# EAGLE schematic +-50vrailtorailwithBoost (EAGLE 9.6.2)
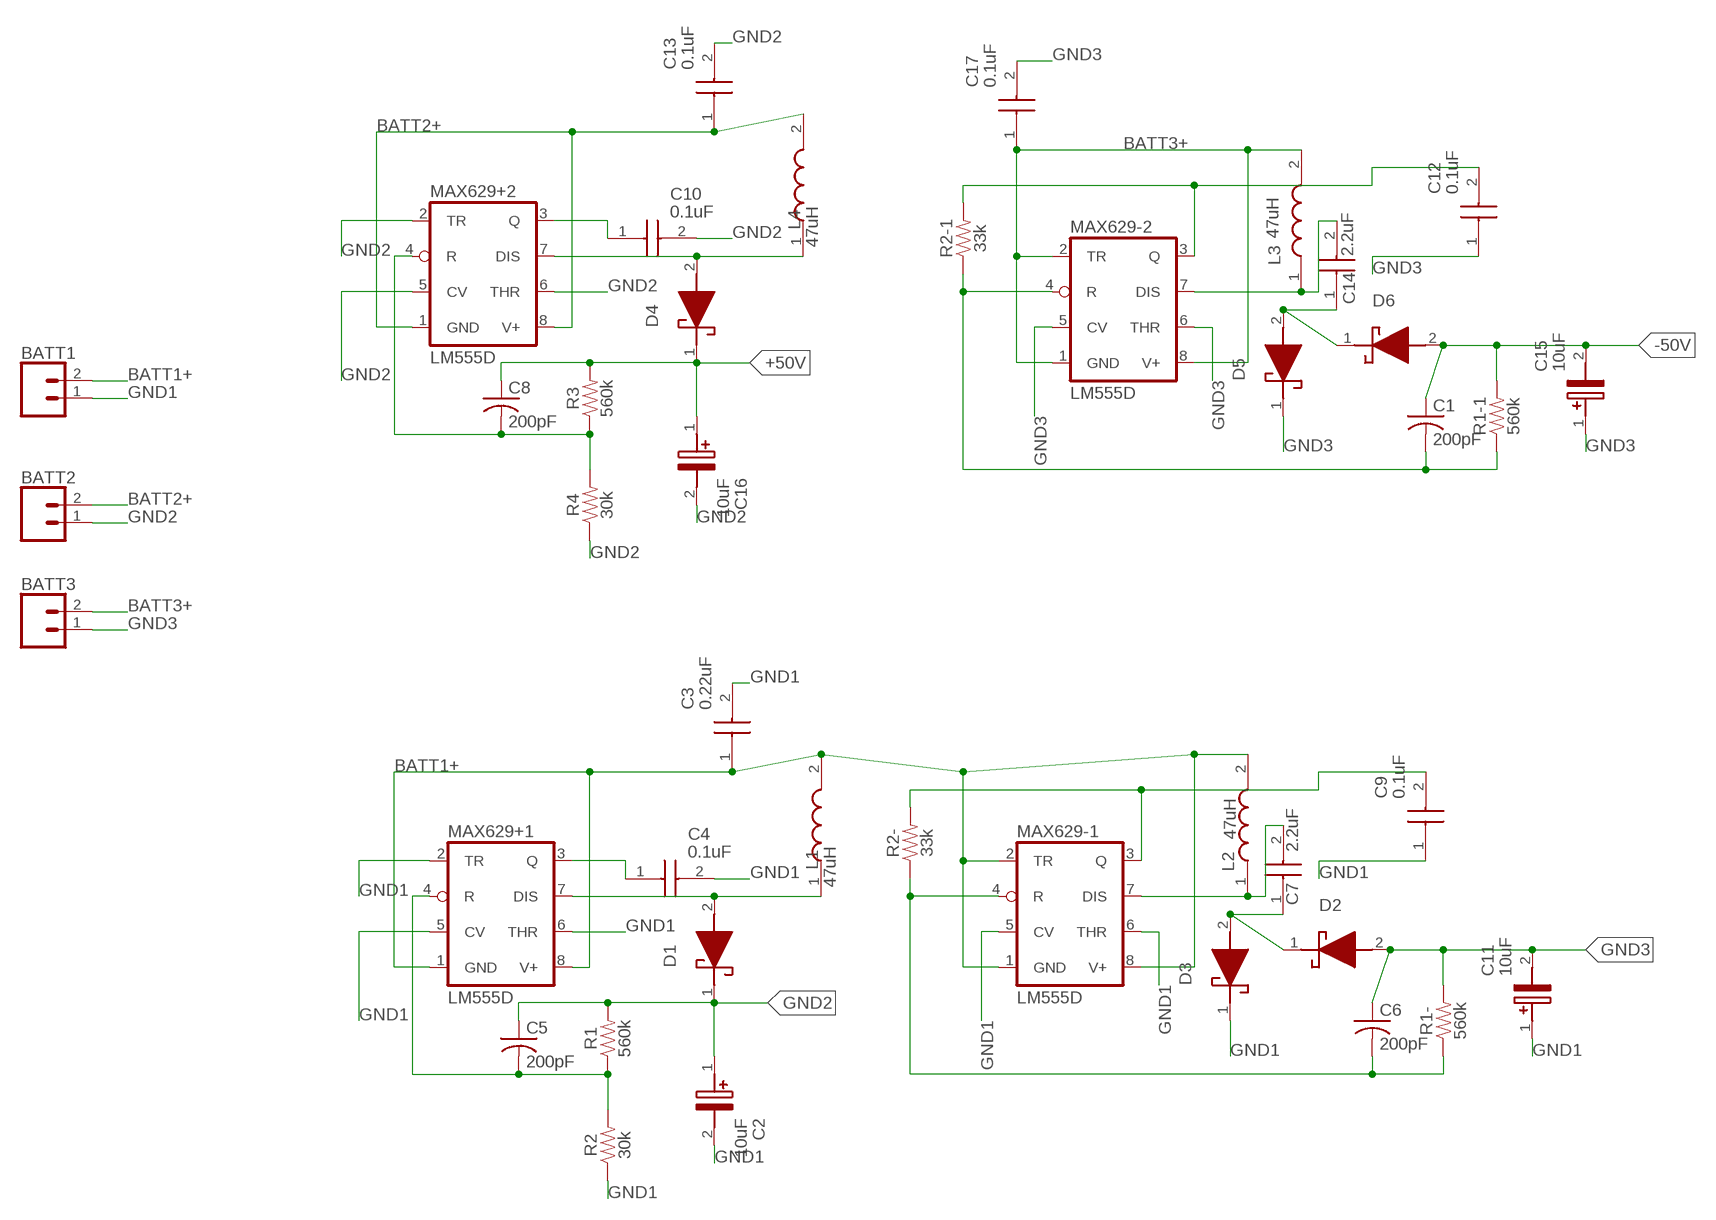
[diagram p0: schematic, sheet 1]

## Parts
BATT1  CONN_02  [1X02]
BATT2  CONN_02  [1X02]
BATT3  CONN_02  [1X02]
C1  200pF  C-USC1206  [C1206]
C2  10uF  EEE-FN1H100UR  [EEE1AA220WR]
C3  0.22uF  C1206C224J1RACAUTO  [C1206]
C4  0.1uF  C1206X222KGRACAUTO  [CAPC3316X195N]
C5  200pF  C-USC1206  [C1206]
C6  200pF  C-USC1206  [C1206]
C7  2.2uF  08055C225KAT2A  [CAPC2012X152N]
C8  200pF  C-USC1206  [C1206]
C9  0.1uF  C1206X222KGRACAUTO  [CAPC3316X195N]
C10  0.1uF  C1206X222KGRACAUTO  [CAPC3316X195N]
C11  10uF  EEE-FN1H100UR  [EEE1AA220WR]
C12  0.1uF  C1206X222KGRACAUTO  [CAPC3316X195N]
C13  0.1uF  C1206C224J1RACAUTO  [C1206]
C14  2.2uF  08055C225KAT2A  [CAPC2012X152N]
C15  10uF  EEE-FN1H100UR  [EEE1AA220WR]
C16  10uF  EEE-FN1H100UR  [EEE1AA220WR]
C17  0.1uF  C1206C224J1RACAUTO  [C1206]
D1  1N5819HW-7  [SOD3716X135N]
D2  1N5819HW-7  [SOD3716X135N]
D3  1N5819HW-7  [SOD3716X135N]
D4  1N5819HW-7  [SOD3716X135N]
D5  1N5819HW-7  [SOD3716X135N]
D6  1N5819HW-7  [SOD3716X135N]
L1  47uH  SLF10145T-470M1R4-PF  [SLF10145]
L2  47uH  SLF10145T-470M1R4-PF  [SLF10145]
L3  47uH  SLF10145T-470M1R4-PF  [SLF10145]
L4  47uH  SLF10145T-470M1R4-PF  [SLF10145]
MAX629+1  LM555D  [SO08]
MAX629+2  LM555D  [SO08]
MAX629-1  LM555D  [SO08]
MAX629-2  LM555D  [SO08]
R1  560k  0.3OHM-0805-1/8W-1%  [0805]
R1-  560k  0.3OHM-0805-1/8W-1%  [0805]
R1-1  560k  0.3OHM-0805-1/8W-1%  [0805]
R2  30k  0.3OHM-0805-1/8W-1%  [0805]
R2-  33k  0.3OHM-0805-1/8W-1%  [0805]
R2-1  33k  0.3OHM-0805-1/8W-1%  [0805]
R3  560k  0.3OHM-0805-1/8W-1%  [0805]
R4  30k  0.3OHM-0805-1/8W-1%  [0805]

## Nets
+50V: C8.1 C16.1(+) D4.1(K) R3.2
-50V: C1.1 C15.2(-) D6.2(A) R1-1.2
BATT1+: BATT1.2 C3.1 L1.2 L2.2 MAX629+1.1(GND) MAX629+1.8(V+) MAX629-1.1(GND) MAX629-1.2(TR) MAX629-1.8(V+)
BATT2+: BATT2.2 C13.1 L4.2 MAX629+2.1(GND) MAX629+2.8(V+)
BATT3+: BATT3.2 C17.1 L3.2 MAX629-2.1(GND) MAX629-2.2(TR) MAX629-2.8(V+)
GND1: BATT1.1 C2.2(-) C3.2 C4.2 C9.1 C11.1(+) D3.1(K) MAX629+1.2(TR) MAX629+1.5(CV) MAX629+1.6(THR) MAX629-1.5(CV) MAX629-1.6(THR) R2.1
GND2: BATT2.1 C2.1(+) C5.1 C10.2 C13.2 C16.2(-) D1.1(K) MAX629+2.2(TR) MAX629+2.5(CV) MAX629+2.6(THR) R1.2 R4.1
GND3: BATT3.1 C6.1 C11.2(-) C12.1 C15.1(+) C17.2 D2.2(A) D5.1(K) MAX629-2.5(CV) MAX629-2.6(THR) R1-.2
N$1: C8.2 MAX629+2.4(R) R3.1 R4.2
N$2: D4.2(A) L4.1 MAX629+2.7(DIS)
N$3: C14.2 L3.1 MAX629-2.7(DIS)
N$4: C1.2 MAX629-2.4(R) R1-1.1 R2-1.1
N$5: C12.2 MAX629-2.3(Q) R2-1.2
N$6: C14.1 D5.2(A) D6.1(K)
N$7: C10.1 MAX629+2.3(Q)
N$13: C5.2 MAX629+1.4(R) R1.1 R2.2
N$21: C4.1 MAX629+1.3(Q)
N$22: D1.2(A) L1.1 MAX629+1.7(DIS)
N$23: C7.2 L2.1 MAX629-1.7(DIS)
N$24: C6.2 MAX629-1.4(R) R1-.1 R2-.1
N$25: C9.2 MAX629-1.3(Q) R2-.2
N$26: C7.1 D2.1(K) D3.2(A)

## Library data of the parts
BATT1-BATT3 = SparkFun-Connectors:CONN_02: Multi connection point. Often used as Generic Header-pin footprint for 0.1 inch spaced/style header connections On any of the 0.1 inch spaced packages, you can populate with these: Break Away Headers - Straight <https://www.sparkfun.com/products/116> (PRT-00116) Break Away Male Headers - Right Angle <https://www.sparkfun.com/products/553> (PRT-00553) Female Headers <https://www.sparkfun.com/products/115> (PRT-00115) Break Away Headers - Machine Pin <https://www.sparkfun.com/products/117> (PRT-00117) Break Away Female Headers - Swiss Machine Pin <https://www.sparkfun.com/products/743> (PRT-00743) For SCREWTERMINALS and SPRING TERMINALS visit here: Screw Terimnals on SparkFun.com <https://www.sparkfun.com/search/results?term=Screw+Terminals> (5mm/3.5mm/2.54mm spacing) This device is also useful as a general connection point to wire up your design to another part of your project. Our various solder wires solder well into these plated through hole pads. Hook-Up Wire - Assortment (Stranded, 22 AWG) <https://www.sparkfun.com/products/11375> (PRT-11375) Hook-Up Wire - Assortment (Solid Core, 22 AWG) <https://www.sparkfun.com/products/11367> (PRT-11367) View the entire wire category on our website here <https://www.sparkfun.com/categories/141> Special notes: Molex polarized connector foot print use with: PRT-08233 with associated crimp pins and housings. 2.54_SCREWTERM for use with PRT-10571. 3.5mm Screw Terminal footprints for PRT-08084 5mm Screw Terminal footprints for use with PRT-08432
C1 C5 C6 C8 = adafruit:C-US: CAPACITOR, American symbol; OC_NEWARK: unknown
C2 C11 C15 C16 = SamacSys_Parts:EEE-FN1H100UR: Aluminum Electrolytic Capacitors - SMD 50VDC 10uF 20% 60mA AEC-Q200 Source: Datasheet <http://industrial.panasonic.com/cdbs/www-data/pdf/RDE0000/RDE0000C1259.pdf>; DESCRIPTION: Aluminum Electrolytic Capacitors - SMD 50VDC 10uF 20% 60mA AEC-Q200; HEIGHT: 5.5mm; MANUFACTURER_NAME: Panasonic; MANUFACTURER_PART_NUMBER: EEE-FN1H100UR; MOUSER_PART_NUMBER: 667-EEE-FN1H100UR; MOUSER_PRICE-STOCK: https://www.mouser.co.uk/ProductDetail/Panasonic/EEE-FN1H100UR?qs=OlC7AqGiEDk6TNrf%252B9WfXA%3D%3D
C3 C13 C17 = SamacSys_Parts:C1206C224J1RACAUTO: SMD Auto X7R, Ceramic, 0.22 uF, 5%, 100 VDC, 250 VDC, 125?C, -55?C, X7R, SMD, MLCC, Temperature Stable, Automotive Grade, 2.5 % , 4.5455 GOhms, 25 mg, 1206, 3.2mm, 1.6mm, 0.9mm, 0.5mm, 4000, 78 Weeks, 80 Source: Datasheet <https://content.kemet.com/datasheets/KEM_C1023_X7R_AUTO_SMD.pdf>; DESCRIPTION: SMD Auto X7R, Ceramic, 0.22 uF, 5%, 100 VDC, 250 VDC, 125?C, -55?C, X7R, SMD, MLCC, Temperature Stable, Automotive Grade, 2.5 % , 4.5455 GOhms, 25 mg, 1206, 3.2mm, 1.6mm, 0.9mm, 0.5mm, 4000, 78 Weeks, 80; HEIGHT: mm; MANUFACTURER_NAME: KEMET; MANUFACTURER_PART_NUMBER: C1206C224J1RACAUTO; MOUSER_PART_NUMBER: 80-C1206C224J1RAUTO; MOUSER_PRICE-STOCK: https://www.mouser.co.uk/ProductDetail/KEMET/C1206C224J1RACAUTO?qs=ds50AKTGxA8%252BykFr3yWSoQ%3D%3D
C4 C9 C10 C12 = SamacSys_Parts:C1206X222KGRACAUTO: Multilayer Ceramic Capacitors MLCC - SMD/SMT 500V 0.1uF X7R 1210 10% Flex Soft AECQ2 Source: Datasheet <https://www.kemet.com/specsheet/C1206X222KGRACAUTO>; DESCRIPTION: Multilayer Ceramic Capacitors MLCC - SMD/SMT 500V 0.1uF X7R 1210 10% Flex Soft AECQ2; HEIGHT: 1.95mm; MANUFACTURER_NAME: KEMET; MANUFACTURER_PART_NUMBER: C1206X222KGRACAUTO; MOUSER_PART_NUMBER: 80-C1206X222KGRAUTO; MOUSER_PRICE-STOCK: https://www.mouser.co.uk/ProductDetail/KEMET/C1206X222KGRACAUTO?qs=MyNHzdoqoQKWtXNcwlVWEw%3D%3D
C7 C14 = SamacSys_Parts:08055C225KAT2A: Multilayer Ceramic Capacitors MLCC - SMD/SMT 2.2UF 50V 10% 0805 Source: Datasheet <http://datasheets.avx.com/X7RDielectric.pdf>; DESCRIPTION: Multilayer Ceramic Capacitors MLCC - SMD/SMT 2.2UF 50V 10% 0805; HEIGHT: 1.52mm; MANUFACTURER_NAME: AVX; MANUFACTURER_PART_NUMBER: 08055C225KAT2A; MOUSER_PART_NUMBER: 581-08055C225KAT2A; MOUSER_PRICE-STOCK: https://www.mouser.co.uk/ProductDetail/AVX/08055C225KAT2A?qs=F5vmRhUsTTrD4i7cuGJbzw%3D%3D
D1-D6 = SamacSys_Parts:1N5819HW-7: Schottky Diodes & Rectifiers Vr/40V Io/1A T/R Source: Datasheet <https://www.diodes.com/assets/Datasheets/ds30217.pdf>; DESCRIPTION: Schottky Diodes & Rectifiers Vr/40V Io/1A T/R; HEIGHT: 1.35mm; MANUFACTURER_NAME: Diodes Inc.; MANUFACTURER_PART_NUMBER: 1N5819HW-7; MOUSER_PART_NUMBER: 621-1N5819HW; MOUSER_PRICE-STOCK: https://www.mouser.co.uk/ProductDetail/Diodes-Incorporated/1N5819HW-7?qs=JV7lzlMm3yIqMakd3pz%2F4g%3D%3D
L1-L4 = SamacSys_Parts:SLF10145T-470M1R4-PF: TDK - SLF10145T-470M1R4-PF - POWER LINE IND, 47UH,1.4A,20% Source: Datasheet <https://product.tdk.com/system/files/dam/doc/product/inductor/inductor/smd/catalog/inductor_commercial_power_slf10145_en.pdf>; DESCRIPTION: TDK - SLF10145T-470M1R4-PF - POWER LINE IND, 47UH,1.4A,20%; HEIGHT: mm; MANUFACTURER_NAME: TDK; MANUFACTURER_PART_NUMBER: SLF10145T-470M1R4-PF; MOUSER_PART_NUMBER: 810-SLF10145T-470M; MOUSER_PRICE-STOCK: https://www.mouser.co.uk/ProductDetail/TDK/SLF10145T-470M1R4-PF?qs=sZ9INdjBHvf6I4eodIlRRw%3D%3D
MAX629+1 MAX629+2 MAX629-1 MAX629-2 = adafruit:*555: TIMER Changed DIP package to have round (not oval) pin pads http://www.ladyada.net/library/pcb/eaglelibrary.html; OC_NEWARK: unknown
R1 R1- R1-1 R2 R2- R2-1 R3 R4 = SparkFun-Resistors:0.3OHM: 0.3Ω resistor A resistor is a passive two-terminal electrical component that implements electrical resistance as a circuit element. Resistors act to reduce current flow, and, at the same time, act to lower voltage levels within circuits. - Wikipedia; PROD_ID: RES-11622; VALUE: 0.3